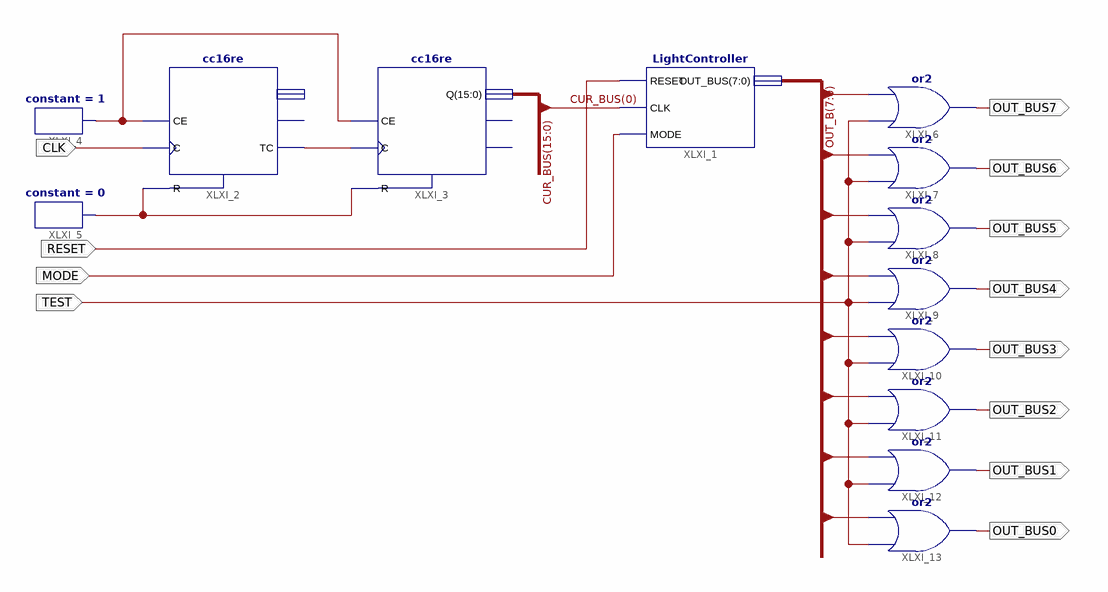
[diagram p0: schematic sheet 1]
// Xilinx ISE schematic TopLevel.sch (spartan3a) as structural Verilog: 13 symbols, 12 ports
module TopLevel (
  input  CLK,
  input  MODE,
  input  RESET,
  input  TEST,
  output OUT_BUS7,
  output OUT_BUS6,
  output OUT_BUS5,
  output OUT_BUS4,
  output OUT_BUS3,
  output OUT_BUS2,
  output OUT_BUS1,
  output OUT_BUS0
);

  wire CLK_1, CONST_0, CONST_1;
  wire [7:0] OUT_B;
  wire [15:0] CUR_BUS;

  LightController XLXI_1 (.RESET(RESET), .CLK(CUR_BUS[0]), .MODE(MODE), .OUT_BUS(OUT_B));
  cc16re XLXI_2 (.C(CLK), .CE(CONST_1), .R(CONST_0), .TC(CLK_1));  // open: CEO, Q
  cc16re XLXI_3 (.C(CLK_1), .CE(CONST_1), .R(CONST_0), .Q(CUR_BUS));  // open: CEO, TC
  constant #(.CValue("1")) XLXI_4 (.O(CONST_1));
  constant #(.CValue("0")) XLXI_5 (.O(CONST_0));
  or XLXI_6 (OUT_BUS7, TEST, OUT_B[7]);
  or XLXI_7 (OUT_BUS6, TEST, OUT_B[6]);
  or XLXI_8 (OUT_BUS5, TEST, OUT_B[5]);
  or XLXI_9 (OUT_BUS4, TEST, OUT_B[4]);
  or XLXI_10 (OUT_BUS3, TEST, OUT_B[3]);
  or XLXI_11 (OUT_BUS2, TEST, OUT_B[2]);
  or XLXI_12 (OUT_BUS1, TEST, OUT_B[1]);
  or XLXI_13 (OUT_BUS0, TEST, OUT_B[0]);
endmodule
